# Altium project Atom-N.PrjPCB
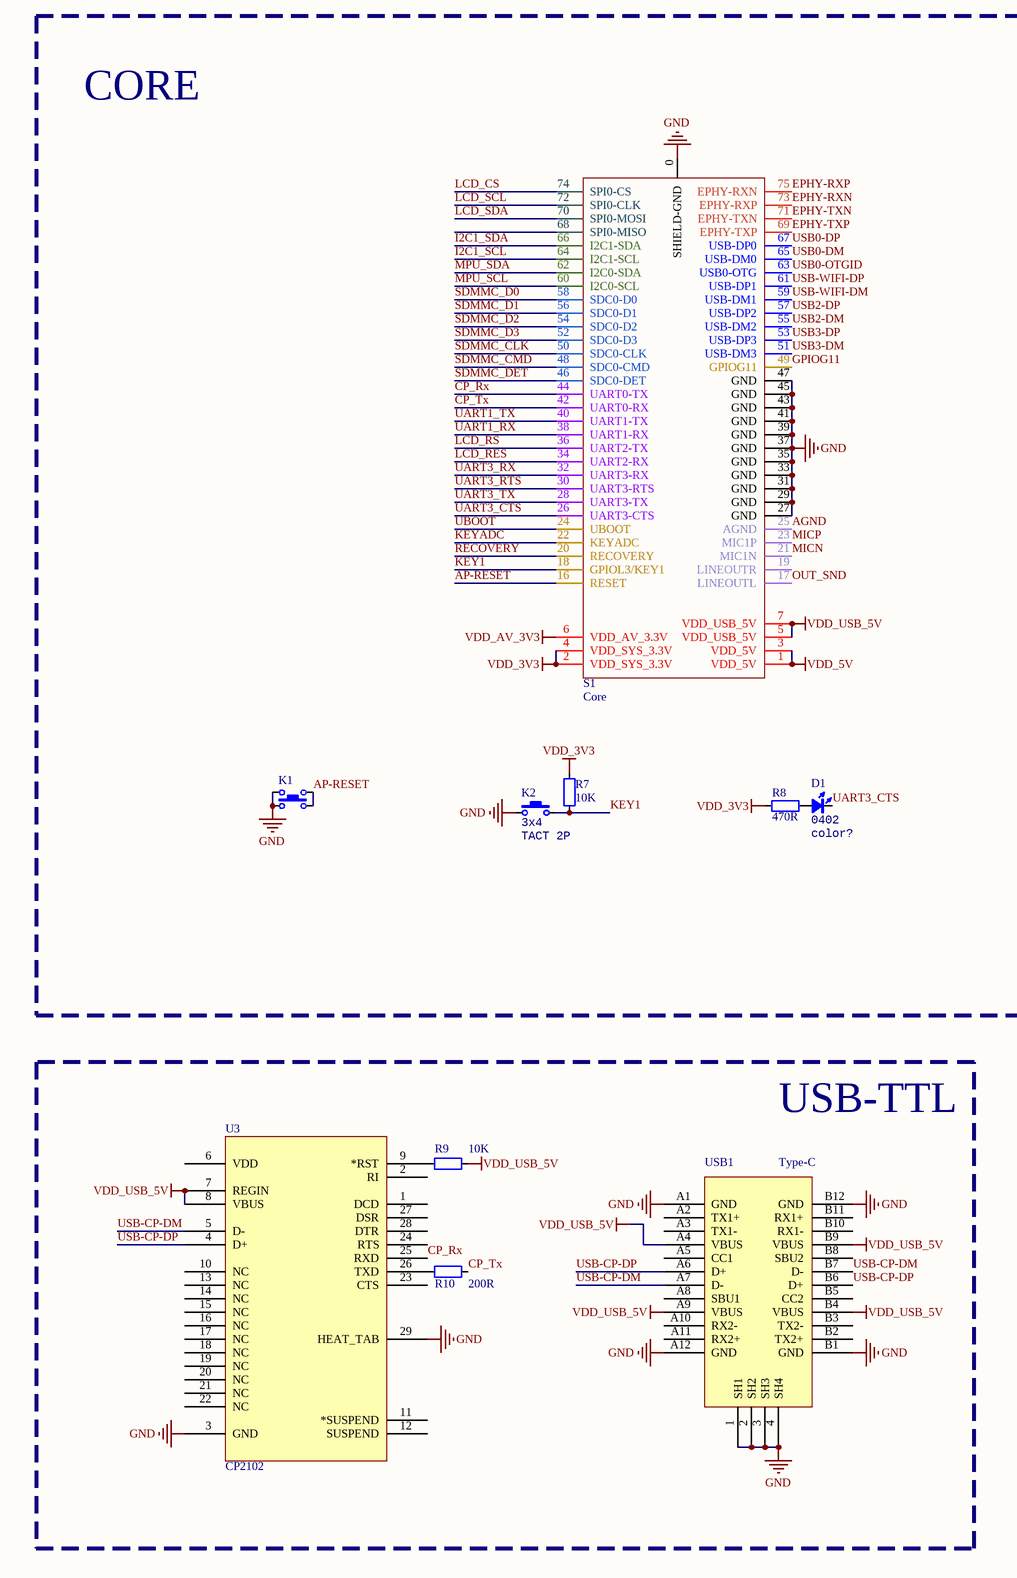
[diagram p0: Atom-N.SchDoc, left]
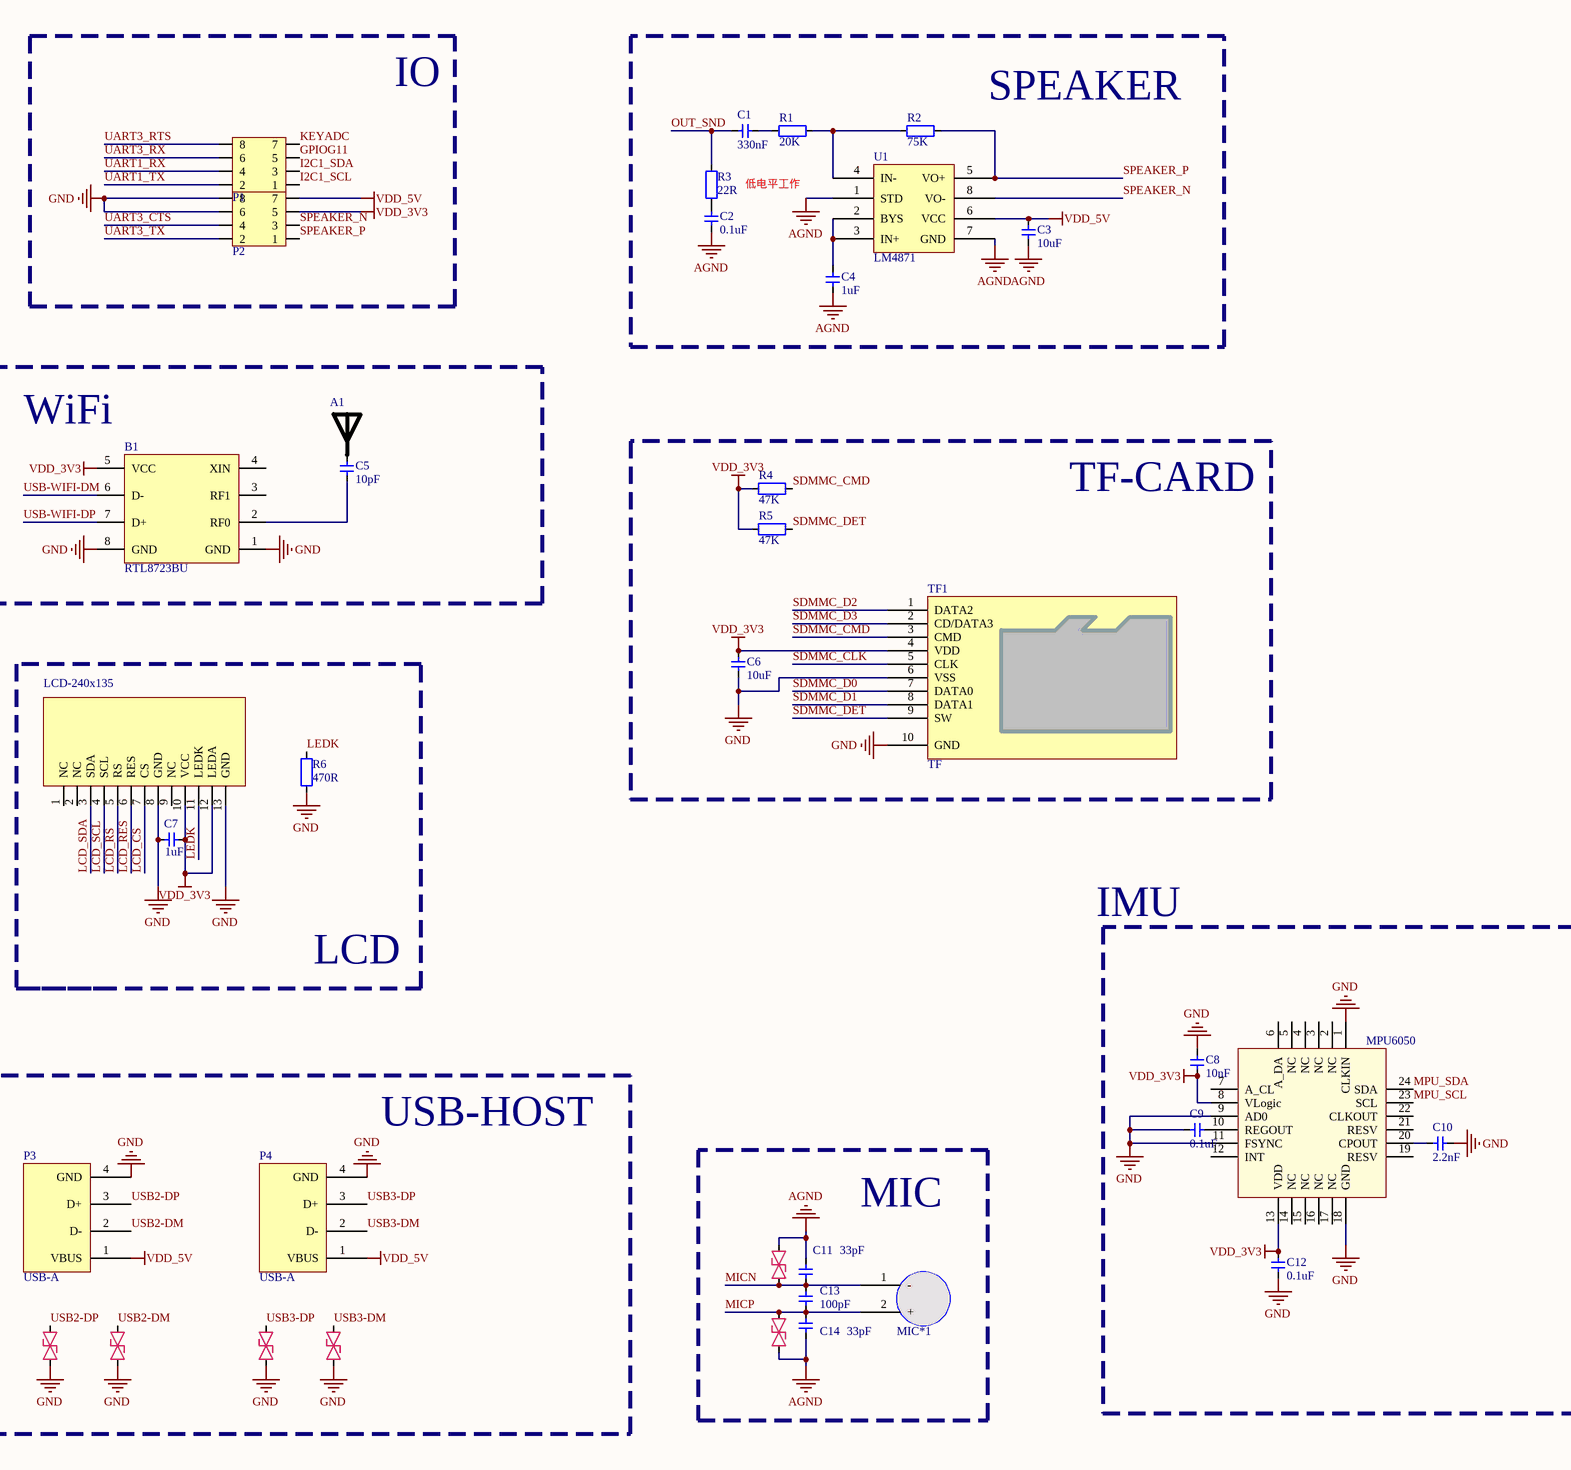
[diagram p1: Atom-N.SchDoc, right]
1 sheet, 47 parts. Net scope: global (net labels, ports and power ports of the same name join across sheets).
Board file: Atom-N.PcbDoc

## Sheet Atom-N.SchDoc: Atom-N
size A2; ApprovedBy: Zhihui Peng; CheckedBy: Zhihui Peng; Author: Zhihui Peng; DrawnBy: Zhihui Peng; Engineer: Zhihui Peng; SheetNumber: 1; SheetTotal: 1; Time: 2020-11-20

### Parts
1  LCD-240x135  [LCD-240x135]
A1  RAINSUN  [ANT-Rainsun-AN5120]  (value not drawn)
B1  RTL8723BU  [USB-WiFI-BT-RTL8723BU]
C1  330nF  [0603-CAP]
C2  0.1uF  [CAP_0402]
C3  10uF  [CAP_0402]
C4  1uF  [CAP_0402]
C5  10pF  [CAP_0402]
C6  10uF  [CAP_0402]
C7  1uF  [CAP_0402]
C8  10nF  [CAP_0402]
C9  0.1uF  [CAP_0402]
C10  2.2nF  [CAP_0402]
C11  33pF  [CAP_0402]
C12  0.1uF  [CAP_0402]
C13  100pF  [CAP_0402]
C14  33pF  [CAP_0402]
D1  Type: 0402  [LED_0402_RED]  (hidden comment: color?)
ESD-1  ESD-0402  [ESD-0402]  (value not drawn)
ESD-2  ESD-0402  [ESD-0402]  (value not drawn)
ESD-3  ESD-0402  [ESD-0402]  (value not drawn)
ESD-4  ESD-0402  [ESD-0402]  (value not drawn)
ESD-5  ESD-0402  [ESD-0402]  (value not drawn)
ESD-6  ESD-0402  [ESD-0402]  (value not drawn)
K1  TACT 4P  [ButtonTACT_3.5*3.55_90]  (value not drawn)
K2  value 3x4  [ButtonTACT_3x4x2_180]  (hidden comment: TACT 2P)
MIC*1  MIC*  [MIC-SMT]  (value not drawn)
P1  HDR2x4_2.54  [HDR2X4_2.0_180H]  (value not drawn)
P2  HDR2x4_2.54  [HDR2X4_2.0_180H]  (value not drawn)
P3  USB-A  [USB-Short]
P4  USB-A  [USB-Short]
R1  20K  [RES_0402]
R2  75K  [RES_0402]
R3  22R  [RES_0402]
R4  47K  [RES_0402]
R5  47K  [RES_0402]
R6  470R  [RES_0402]
R7  10K  [RES_0402]
R8  470R  [RES_0402]
R9  10K  [RES_0402]
R10  200R  [RES_0402]
S1  Core  [QUANTUM-QUARK-N]
TF1  TF  [TF-SOCKET - short]
U1  LM4871  [MSOP-8]
U2  MPU6050  [QFN-24]
U3  CP2102  [QFN-28]
USB1  Type-C  [Type-C-TOP]

### Blocks framed on the sheet
IO: P1 P2
SPEAKER: C1-C4 R1-R3 U1
TF-CARD: C6 R4 R5 TF1
USB-HOST: ESD-3-ESD-6 P3 P4

### Nets
AGND: C2.1 C3.1 C4.1 C11.1 C14.1 ESD-1.2 ESD-2.1 S1.25(AGND) U1.1(STD) U1.7(GND)
GND: 1.8(GND) 1.13(GND) B1.1(GND) B1.8(GND) C6.1 C7.2 C8.2 C9.2 C10.1 C12.1 ESD-3.1 ESD-4.1 ESD-5.1 ESD-6.1 K1.1 K1.3 K2.1 P2.6 P2.8 P3.4(GND) P4.4(GND) R6.1 S1.27(GND) S1.29(GND) S1.31(GND) S1.33(GND) S1.35(GND) S1.37(GND) S1.39(GND) S1.41(GND) S1.43(GND) S1.45(GND) S1.47(GND) TF1.6(VSS) TF1.10(GND) U2.1(CLKIN) U2.9(AD0) U2.11(FSYNC) U2.18(GND) U3.3(GND) U3.29(HEAT_TAB) USB1.1(SH1) USB1.2(SH2) USB1.3(SH3) USB1.4(SH4) USB1.A1(GND) USB1.A12(GND) USB1.B1(GND) USB1.B12(GND)
VDD_3V3: 1.10(VCC) 1.12(LEDA) B1.5(VCC) C6.2 C7.1 C8.1 C12.2 P2.5 R4.1 R5.1 R7.2 R8.2 S1.2(VDD_SYS_3.3V) S1.4(VDD_SYS_3.3V) TF1.4(VDD) U2.8(VLogic) U2.13(VDD)
VDD_5V: C3.2 P2.7 P3.1(VBUS) P4.1(VBUS) S1.1(VDD_5V) S1.3(VDD_5V) U1.6(VCC)
VDD_AV_3V3: S1.6(VDD_AV_3.3V)
VDD_USB_5V: R9.1 S1.5(VDD_USB_5V) S1.7(VDD_USB_5V) U3.7(REGIN) U3.8(VBUS) USB1.A4(VBUS) USB1.A9(VBUS) USB1.B4(VBUS) USB1.B9(VBUS)
AP-RESET: K1.2 K1.4 S1.16(RESET)
CP_Rx: S1.44(UART0-TX) U3.25(RXD)
CP_Tx: R10.1 S1.42(UART0-RX)
EPHY-RXN: S1.73(EPHY-RXP)
EPHY-RXP: S1.75(EPHY-RXN)
EPHY-TXN: S1.71(EPHY-TXN)
EPHY-TXP: S1.69(EPHY-TXP)
GPIOG11: P1.5 S1.49(GPIOG11)
I2C1_SCL: P1.1 S1.64(I2C1-SCL)
I2C1_SDA: P1.3 S1.66(I2C1-SDA)
KEY1: K2.2 R7.1 S1.18(GPIOL3/KEY1)
KEYADC: P1.7 S1.22(KEYADC)
LCD_CS: 1.7(CS) S1.74(SPI0-CS)
LCD_RES: 1.6(RES) S1.34(UART2-RX)
LCD_RS: 1.5(RS) S1.36(UART2-TX)
LCD_SCL: 1.4(SCL) S1.72(SPI0-CLK)
LCD_SDA: 1.3(SDA) S1.70(SPI0-MOSI)
LEDK: 1.11(LEDK) R6.2
MICN: C11.2 C13.2 ESD-1.1 MIC*1.1(-) S1.21(MIC1N)
MICP: C13.1 C14.2 ESD-2.2 MIC*1.2(+) S1.23(MIC1P)
MPU_SCL: S1.60(I2C0-SCL) U2.23(SCL)
MPU_SDA: S1.62(I2C0-SDA) U2.24(SDA)
OUT_SND: C1.2 R3.2 S1.17(LINEOUTL)
RECOVERY: S1.20(RECOVERY)
SDMMC_CLK: S1.50(SDC0-CLK) TF1.5(CLK)
SDMMC_CMD: R4.2 S1.48(SDC0-CMD) TF1.3(CMD)
SDMMC_D0: S1.58(SDC0-D0) TF1.7(DATA0)
SDMMC_D1: S1.56(SDC0-D1) TF1.8(DATA1)
SDMMC_D2: S1.54(SDC0-D2) TF1.1(DATA2)
SDMMC_D3: S1.52(SDC0-D3) TF1.2(CD/DATA3)
SDMMC_DET: R5.2 S1.46(SDC0-DET) TF1.9(SW)
SPEAKER_N: P2.3 U1.8(VO-)
SPEAKER_P: P2.1 R2.2 U1.5(VO+)
UART1_RX: P1.4 S1.38(UART1-RX)
UART1_TX: P1.2 S1.40(UART1-TX)
UART3_CTS: D1.2(K) P2.4 S1.26(UART3-CTS)
UART3_RTS: P1.8 S1.30(UART3-RTS)
UART3_RX: P1.6 S1.32(UART3-RX)
UART3_TX: P2.2 S1.28(UART3-TX)
UBOOT: S1.24(UBOOT)
USB0-DM: S1.65(USB-DM0)
USB0-DP: S1.67(USB-DP0)
USB0-OTGID: S1.63(USB0-OTG)
USB2-DM: ESD-4.2 P3.2(D-) S1.55(USB-DM2)
USB2-DP: ESD-3.2 P3.3(D+) S1.57(USB-DP2)
USB3-DM: ESD-6.2 P4.2(D-) S1.51(USB-DM3)
USB3-DP: ESD-5.2 P4.3(D+) S1.53(USB-DP3)
USB-CP-DM: U3.5(D-) USB1.A7(D-) USB1.B7(D-)
USB-CP-DP: U3.4(D+) USB1.A6(D+) USB1.B6(D+)
USB-WIFI-DM: B1.6(D-) S1.59(USB-DM1)
USB-WIFI-DP: B1.7(D+) S1.61(USB-DP1)
NetA1_1: A1.1 C5.1
NetB1_2: B1.2(RF0) C5.2
NetC1_1: C1.1 R1.1
NetC2_2: C2.2 R3.1
NetC4_2: C4.2 U1.2(BYS) U1.3(IN+)
NetC9_1: C9.1 U2.10(REGOUT)
NetC10_2: C10.2 U2.20(CPOUT)
NetD1_1: D1.1(A) R8.1
NetR1_2: R1.2 R2.1 U1.4(IN-)
NetR9_2: R9.2 U3.9(*RST)
NetR10_2: R10.2 U3.26(TXD)

Not connected (* = marked no-connect by the designer): 1 1(NC) 2(NC) 9(NC); B1 3(RF1) 4(XIN); S1 0(SHIELD-GND) 19(LINEOUTR) 68(SPI0-MISO); U2 2(NC) 3(NC) 4(NC) 5(NC) 6(A_DA) 7(A_CL) 12(INT) 14(NC) 15(NC) 16(NC) 17(NC) 19(RESV) 21(RESV) 22(CLKOUT); U3 1(DCD) 2(RI) 6(VDD) 10(NC) 11(*SUSPEND) 12(SUSPEND) 13(NC) 14(NC) 15(NC) 16(NC) 17(NC) 18(NC) 19(NC) 20(NC) 21(NC) 22(NC) 23(CTS) 24(RTS) 27(DSR) 28(DTR); USB1 A2(TX1+) A3(TX1-) A5(CC1) A8(SBU1) A10(RX2-) A11(RX2+) B2(TX2+) B3(TX2-) B5(CC2) B8(SBU2) B10(RX1-) B11(RX1+)

### Notes on the sheet
- CORE
- 低电平工作
- (near B1) WiFi
- IMU
- LCD
- USB-TTL
- MIC
- Labels drawn without touching a wire or pin: GND

### Library data of the parts
1 = LCD-240x135: 显示屏
A1 = ANT-Rainsun-AP5120
B1 = USB-WiFi-BT-RTL8723BU
C1 = 电容-0603: Capacitor; Value: 0.1u
C2-C14 = 电容-0402: Capacitor; Value: 0.1u
D1 = LED_0402: LED; Value: color?
ESD-1-ESD-6 = ESD-0402: ESD
K1 = ButtonTACT: Button; value: 3.4x3.5; type: TACT 4P
K2 = ButtonTACT_3x4x2_180: Button; type: TACT 2P
MIC*1 = MIC
P1 P2 = HDR2x4_2.54: Header
R1 R2 R4-R10 = 电阻-0402: Resistor; Value: 22R
R3 = 电阻-0402: Resistor; Value: 22R
S1 = Quantum-Quark-N
TF1 = TF卡座: 8脚自弹
U2 = MPU6050: 六轴传感器
U3 = CP2102: USB转TTL; PART DESC: SINGLE-CHIP USB TO UART BRIDGE, QFN28, RoHS.; MFG #1: SILICON LABS; PART NUMBER: CP2102; Value: Value; RefDes: RefDes; Type: DEV
USB1 = USB-Type-C-TOP